# EAGLE design fanspeed (EAGLE 8.1.0)
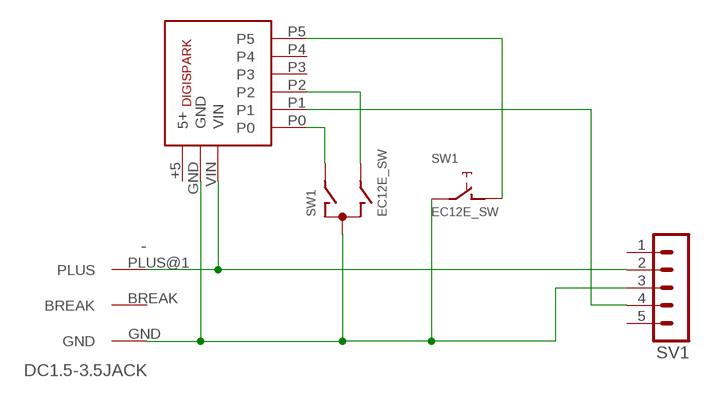
[diagram p0: schematic, sheet 1]

## Parts
-  DC1.5-3.5JACK  [DC1.5-3.5JACK]
SV1  MA05-1  [MA05-1]
SW1  EC12E_SW  [ALPS_EC12E_SW]
U1  DIGISPARK  [DISPARK-BOARD]

## Nets
GND: -.GND SV1.3 SW1.C SW1.E U1.GND
N$1: SW1.D U1.P5
N$3: SW1.B U1.P2
N$4: SV1.4 U1.P1
N$5: SW1.A U1.P0
N$7: -.PLUS@1(PLUS) SV1.2 U1.VIN
Unconnected: -.BREAK SV1.1 SV1.5 SW1.GND1(G) SW1.GND2(G) U1.+5(5+) U1.P3 U1.P4

## Library data of the parts
- = dcjack:DC1.5-3.5JACK: dc jack for 1.5mm pin 3.5mm barrel
SV1 = con-lstb:MA05-1: PIN HEADER; OC_FARNELL: unknown; OC_NEWARK: unknown
SW1 = switch-alps:EC12E_SW: ALPS rotary Encoder EC12E series with switch; MPN: EC12E2424407; OC_FARNELL: 1520813; OC_NEWARK: 74M1068
U1 = Patavium:DIGISPARK: The GY Tiny85 is a Digispark USB Clone, a Attiny85 based microcontroller development board similar to the Arduino line, only cheaper, smaller, and a bit less powerful. With a whole host of shields to extend its functionality and the ability to use the familiar Arduino IDE the Digispark is a great way to jump into electronics, or perfect for when an Arduino is too big or too much.

## Board
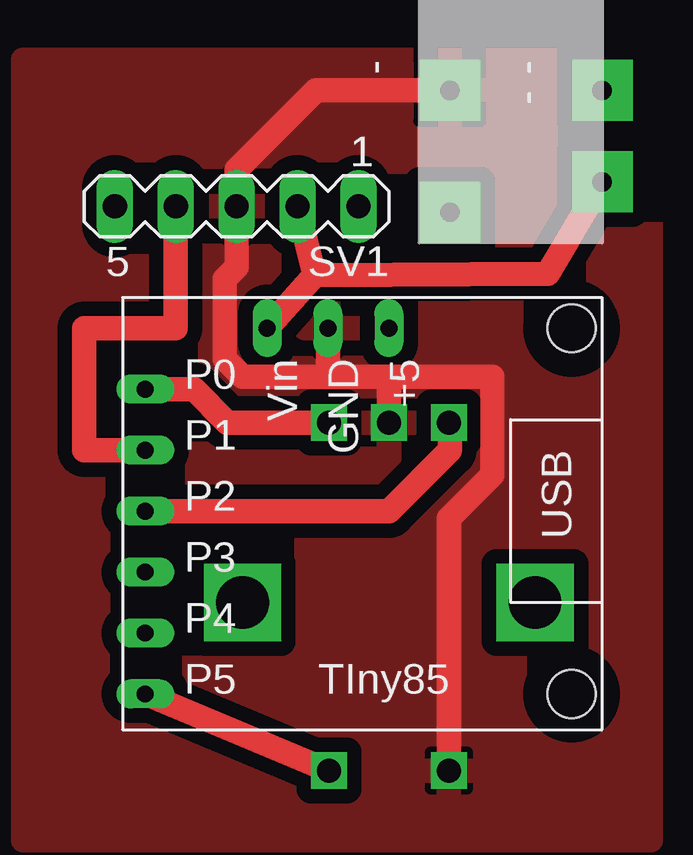
[diagram p1: board, top side]
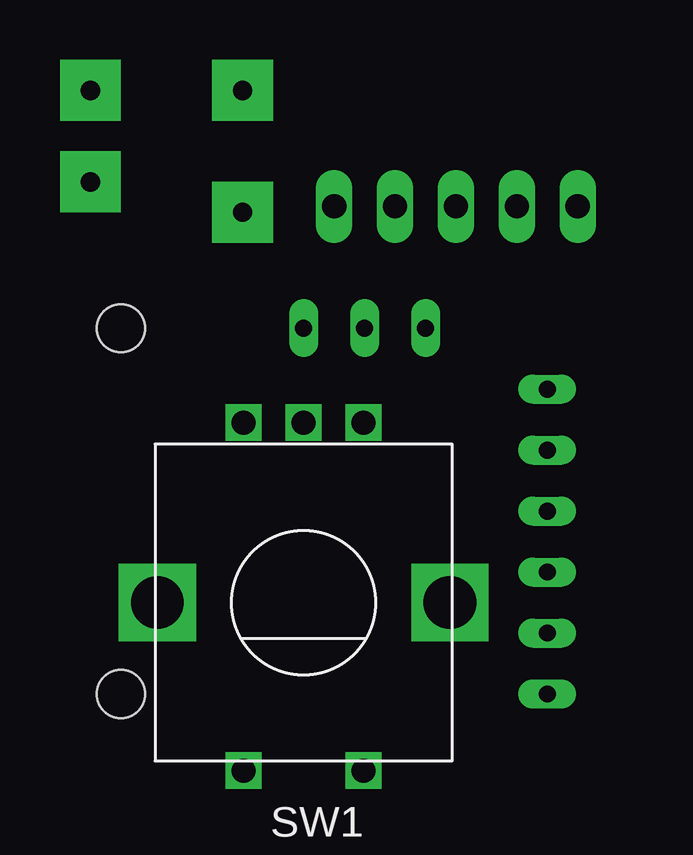
[diagram p2: board, bottom side, seen from below]

No outline drawn. Coordinates in mm, seen from the top.
Copper layers (1*16): Top 0.035mm / dielectric 1.5mm / Bottom 0.035mm
Design rules "default": minimum track width 10mil, minimum drill 24mil, track to track 8mil, track to pad 8mil, pad to pad 8mil, via to via 8mil, smd to smd 8mil, copper to edge 40mil, drill to drill 8mil, minimum pad ring 10mil, minimum via ring 8mil, stop-mask expansion 4mil, vias tented up to drill 0mil, thermal gap 10mil

### Footprints (pad centres in the part's own frame; a part is rotated, then mirrored left to right if it is on the bottom)
DC1.5-3.5JACK = drill 0.8 pad 2.54 square: BREAK 5.08,-6.35; GND 0,-6.35; PLUS@1 3.81,0; PLUS@2 0,0
MA05-1 = drill 1.016 long: 1 -5.08,0; 2 -2.54,0; 3 0,0; 4 2.54,0; 5 5.08,0
ALPS_EC12E_SW = drill 1 square: A -2.5,-7.5; B 2.5,-7.5; C 0,-7.5; D -2.5,7; E 2.5,7 | drill 2.2 square: GND1 -6.1,0; GND2 6.1,0
DISPARK-BOARD = drill 0.7 long: +5 8.89,1.27; GND 11.43,1.27; P0 19.05,3.81; P1 19.05,6.35; P2 19.05,8.89; P3 19.05,11.43; P4 19.05,13.97; P5 19.05,16.51; VIN 13.97,1.27 | hole 2: 1.27,1.27; 1.27,16.51

### Placement (x,y rotation side)
-  31.75,30.23 270 top
SV1  16.51,25.4 180 top
SW1  22.86,8.89 180 bottom
U1  31.75,21.59 180 top

### Tracks (layer width: path | path; a pad name or v marks a point on that pad's centre or on a via)
GND
  Top 1.016: SW1.C 22.86,18.29 | SW1.E 25.36,12.41 27.18,14.22 27.18,18.29 22.86,18.29 | -.GND 19.81,30.23 16.51,26.92 SV1.3 16.51,22.86 16,22.35 16,19.05 16.76,18.29 20.32,18.29 | 22.86,18.29 20.32,18.29 | 20.32,18.29 U1.GND
  pour Top (isolate 0.61): 7.62,31.5 33.78,31.5 33.78,-1.02 7.62,-1.02
N$1
  Top 1.016: U1.P5 SW1.D
N$3
  Top 1.016: U1.P2 22.86,12.7 25.4,15.24 25.4,16.35 SW1.B
N$4
  Top 1.016: U1.P1 10.16,15.24 10.16,20.32 13.97,20.32 SV1.4
N$5
  Top 1.016: SW1.A 16.12,16.39 14.73,17.78 U1.P0
N$7
  Top 1.016: 19.77,22.53 U1.VIN | 19.77,22.53 SV1.2 | -.PLUS@1 29.49,22.59 19.77,22.53